# Altium schematic sheet 2022_AESK_UAV_CAN.SchDoc
size A4
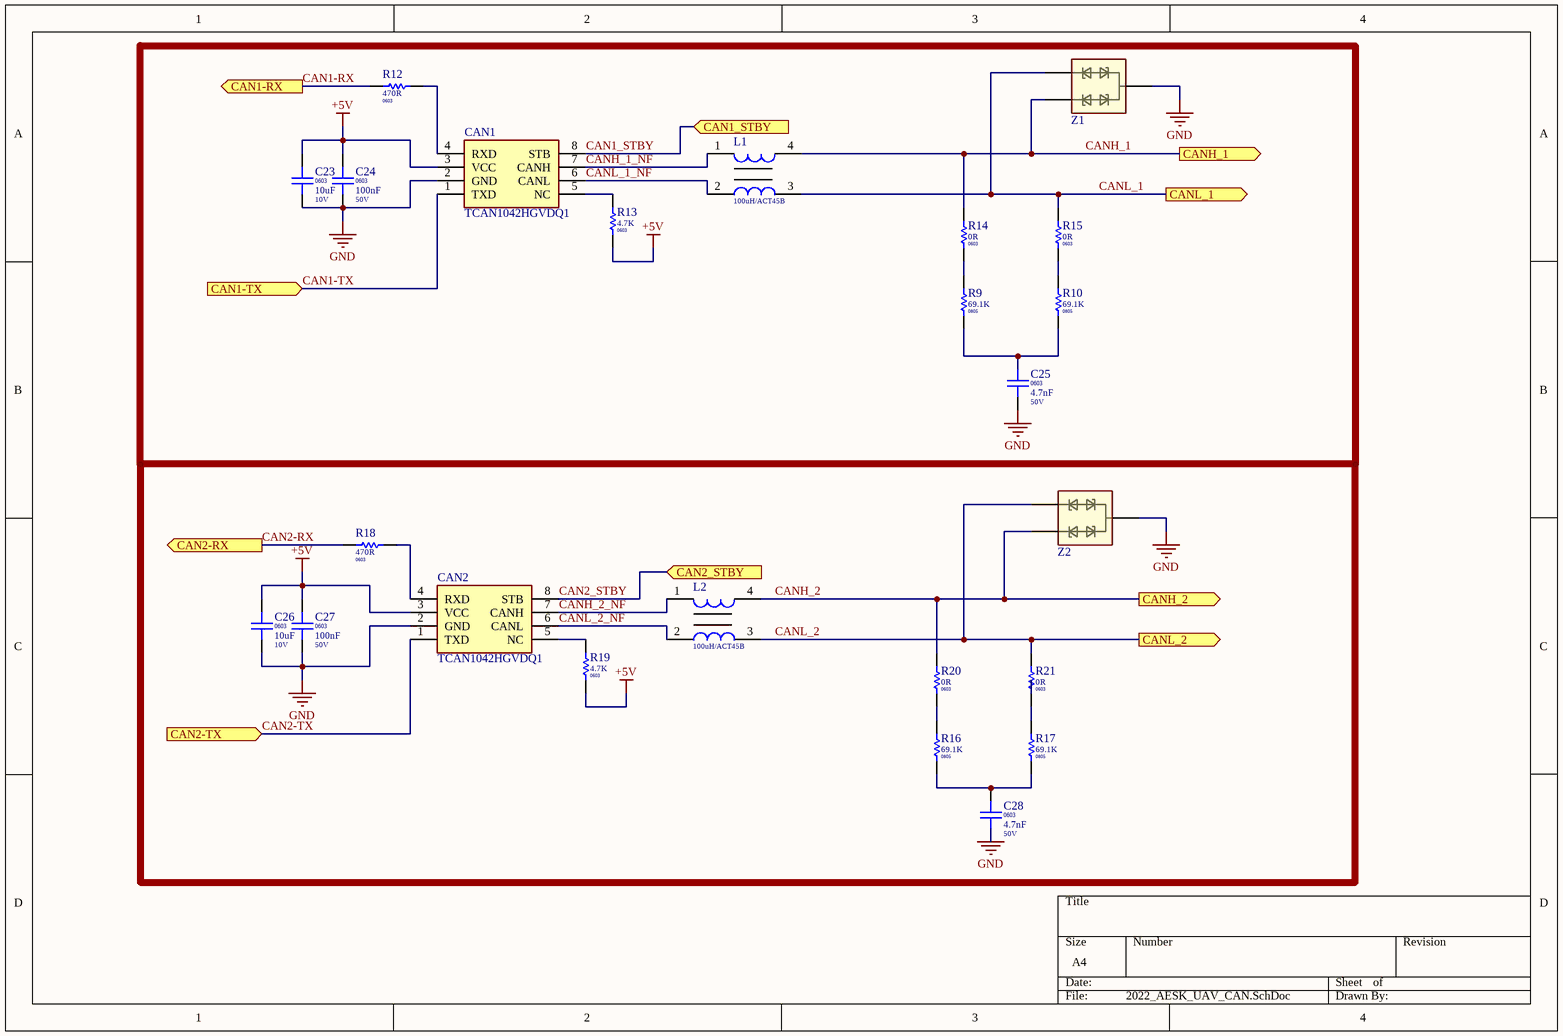
[diagram p0: 2022_AESK_UAV_CAN.SchDoc]

## Parts
C23  Package / Case: 0603  Voltage: 10V  [CAPC 0603]  (hidden comment: 10uF)
C24  Package / Case: 0603  Voltage: 50V  [CAPC 0603]  (hidden comment: 100nF)
C25  Package / Case: 0603  Voltage: 50V  [CAPC 0603]  (hidden comment: 4.7nF)
C26  Package / Case: 0603  Voltage: 10V  [CAPC 0603]  (hidden comment: 10uF)
C27  Package / Case: 0603  Voltage: 50V  [CAPC 0603]  (hidden comment: 100nF)
C28  Package / Case: 0603  Voltage: 50V  [CAPC 0603]  (hidden comment: 4.7nF)
CAN1  TCAN1042HGVDQ1  [SOIC127P600X175-8N]
CAN2  TCAN1042HGVDQ1  [SOIC127P600X175-8N]
L1  Name: 100uH/ACT45B  [TDK_ACT45B_2]  (hidden comment: ACT45B-101-2P-TL003)
L2  Name: 100uH/ACT45B  [TDK_ACT45B_2]  (hidden comment: ACT45B-101-2P-TL003)
R9  Package / Case: 0805  [RESC 0805]  (hidden comment: 69.1K)
R10  Package / Case: 0805  [RESC 0805]  (hidden comment: 69.1K)
R12  Package / Case: 0603  [RESC 0603]  (hidden comment: 470R)
R13  Package / Case: 0603  [RESC 0603]  (hidden comment: 4.7K)
R14  Package / Case: 0603  [RESC 0603]  (hidden comment: 0R)
R15  Package / Case: 0603  [RESC 0603]  (hidden comment: 0R)
R16  Package / Case: 0805  [RESC 0805]  (hidden comment: 69.1K)
R17  Package / Case: 0805  [RESC 0805]  (hidden comment: 69.1K)
R18  Package / Case: 0603  [RESC 0603]  (hidden comment: 470R)
R19  Package / Case: 0603  [RESC 0603]  (hidden comment: 4.7K)
R20  Package / Case: 0603  [RESC 0603]  (hidden comment: 0R)
R21  Package / Case: 0603  [RESC 0603]  (hidden comment: 0R)
Z1  PESD2CAN,215  [SOT95P230X110-3N]  (value not drawn)
Z2  PESD2CAN,215  [SOT95P230X110-3N]  (value not drawn)

## Ports
CAN1-RX (out), CAN1-TX (in), CAN1_STBY (in), CAN2-RX (out), CAN2-TX (in), CAN2_STBY (in), CANH_1 (out), CANH_2 (out), CANL_1 (out), CANL_2 (out)

## Nets
+5V: C23.2 C24.2 C26.2 C27.2 CAN1.3(VCC) CAN2.3(VCC) R13.1 R19.1
GND: C23.1 C24.1 C25.1 C26.1 C27.1 C28.2 CAN1.2(GND) CAN2.2(GND) Z1.3 Z2.3
CAN1-RX: R12.1 ; port CAN1-RX
CAN1-TX: CAN1.1(TXD) ; port CAN1-TX
CAN1_STBY: CAN1.8(STB) ; port CAN1_STBY
CAN2-RX: R18.1 ; port CAN2-RX
CAN2-TX: CAN2.1(TXD) ; port CAN2-TX
CAN2_STBY: CAN2.8(STB) ; port CAN2_STBY
CANH_1: L1.4 R14.2 Z1.2 ; port CANH_1
CANH_1_NF: CAN1.7(CANH) L1.1
CANH_2: L2.4 R20.2 Z2.2 ; port CANH_2
CANH_2_NF: CAN2.7(CANH) L2.1
CANL_1: L1.3 R15.2 Z1.1 ; port CANL_1
CANL_1_NF: CAN1.6(CANL) L1.2
CANL_2: L2.3 R21.2 Z2.1 ; port CANL_2
CANL_2_NF: CAN2.6(CANL) L2.2
NetC25_2: C25.2 R9.1 R10.1
NetC28_1: C28.1 R16.1 R17.1
NetCAN1_4: CAN1.4(RXD) R12.2
NetCAN1_5: CAN1.5(NC) R13.2
NetCAN2_4: CAN2.4(RXD) R18.2
NetCAN2_5: CAN2.5(NC) R19.2
NetR9_2: R9.2 R14.1
NetR10_2: R10.2 R15.1
NetR16_2: R16.2 R20.1
NetR17_2: R17.2 R21.1

## Library data of the parts
C23 C26 = CAPC0473: Capacitor Ceramic 10uF 10V 0603; Tolerance: %10; Value Rating: uF; Favorites: Favorite; Value: 10uF; Part Number: CAPC0473; Category: Capacitor Ceramic; Values: 10uF 10V
C24 C27 = CAPC0285: Capacitor Ceramic 100nF 50V 0603; Tolerance: %10; Value Rating: nF; Favorites: Favorite; Value: 100nF; Part Number: CAPC0285; Category: Capacitor Ceramic; Values: 100nF 50V
C25 C28 = CAPC0273: Capacitor Ceramic 4.7nF 50V 0603; Tolerance: %10; Value Rating: nF; Value: 4.7nF; Part Number: CAPC0273; Category: Capacitor Ceramic; Values: 4.7nF 50V
CAN1 CAN2 = TCAN1042HGVDQ1: Integrated Circuit; Manufacturer_Name: Texas Instruments; Manufacturer_Part_Number: TCAN1042HDRQ1; Datasheet Link: http://www.ti.com/lit/gpn/tcan1042hgv-q1; Height: 1.75mm; Mouser Part Number: 595-TCAN1042HGVDQ1; Mouser Price/Stock: https://www.mouser.com/Search/Refine.aspx?Keyword=595-TCAN1042HGVDQ1; RS Part Number: 1330710P; RS Price/Stock: http://uk.rs-online.com/web/p/products/1330710P; Supplier 1: Digi-Key; Supplier Part Number 1: 296-47722-ND
L1 L2 = ACT45B-101-2P-TL003: Inductor; Manufacturer Name: TDK; Datasheet Link: https://product.tdk.com/info/en/catalog/datasheets/cmf_automotive_signal_act45b_en.pdf; Mouser Price/Stock: https://www.mouser.com/Search/Refine.aspx?Keyword=810-ACT45B1012PTL003
R9 R16 R17 = R0386: 68K 0805; Part Number: R0386; Tolerance: %5; Power: 1/10W; Value: 69.1K; Category: Resistor; Values: 68K
R10 = R0386: 69.1K 0805; Part Number: R0386; Tolerance: %5; Power: 1/10W; Values: 68K; Value: 69.1K; Category: Resistor
R12 R18 = R0188: 470R 0603; Part Number: R0188; Tolerance: %5; Power: 1/10W; Value: 470R; Category: Resistor; Values: 470R
R13 R19 = R0212: 4.7K 0603; Part Number: R0212; Tolerance: %5; Power: 1/10W; Value: 4.7K; Category: Resistor; Values: 4.7K
R14 R15 R20 R21 = R0148: 0R 0603; Part Number: R0148; Tolerance: %5; Power: 1/10W; Value: 0R; Category: Resistor; Values: 0R
Z1 Z2 = PESD2CAN,215: Zener Diode; Manufacturer_Name: Nexperia; Datasheet Link: http://de.rs-online.com/webdocs/0b4d/0900766b80b4dbb6.pdf; Height: 1.1mm; Manufacturer_Part_Number: PESD2CAN,215; Mouser Part Number: 771-PESD2CAN-T/R; Mouser Price/Stock: https://www.mouser.com/Search/Refine.aspx?Keyword=771-PESD2CAN-T%2FR; RS Part Number: 0508462; RS Price/Stock: http://uk.rs-online.com/web/p/products/0508462